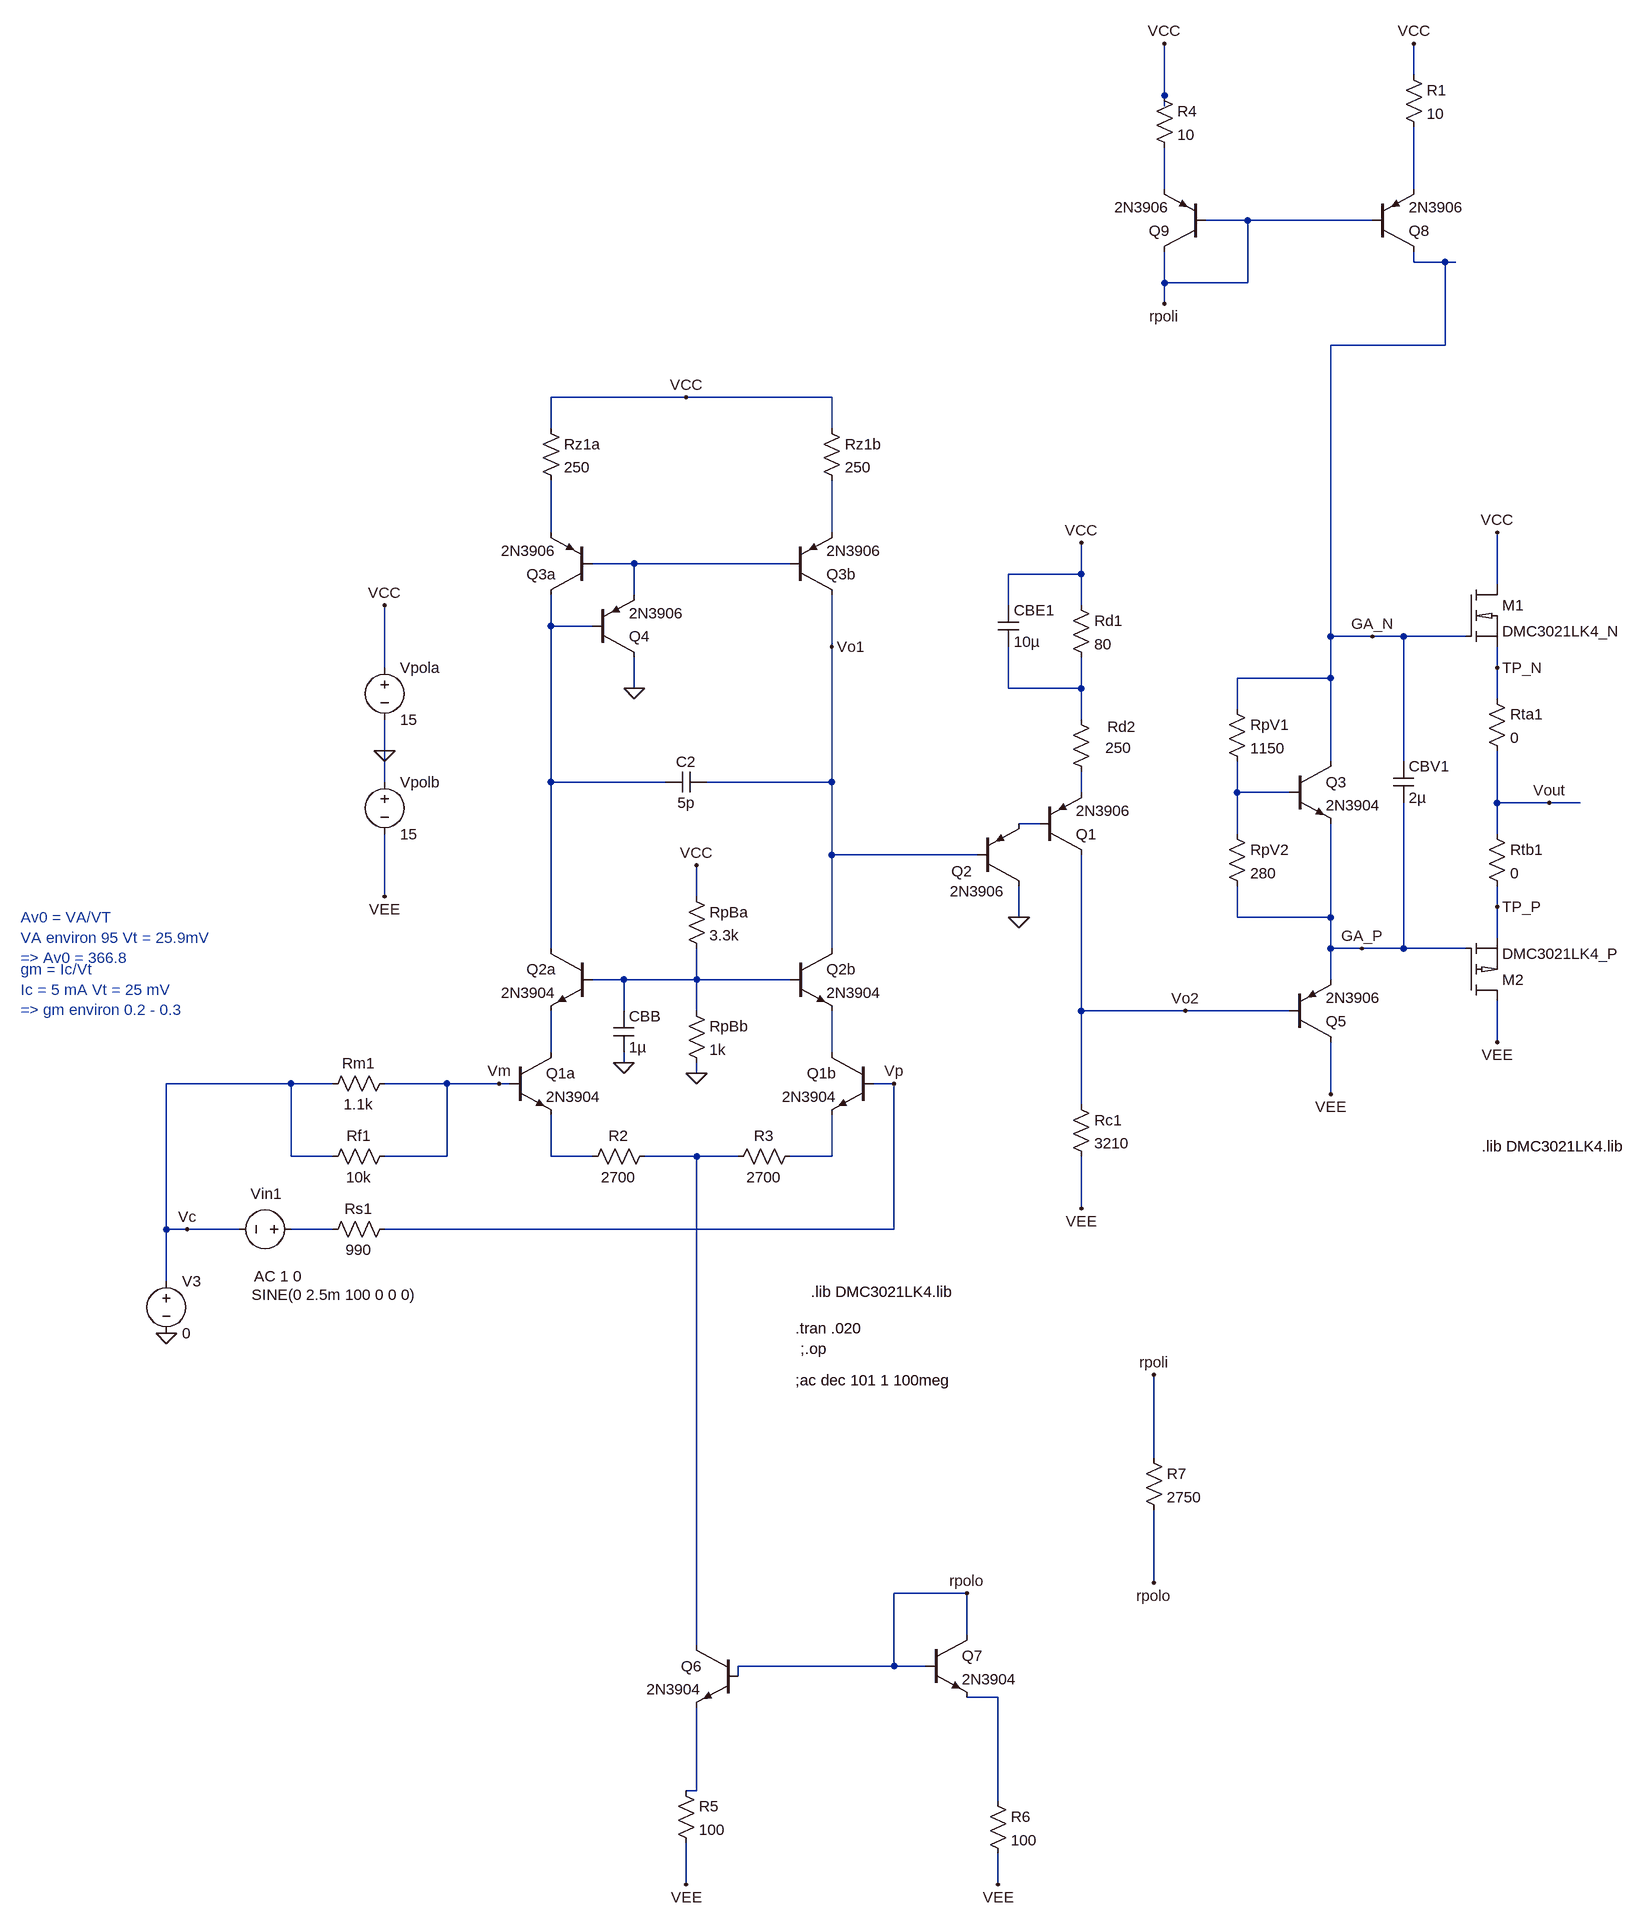
[diagram p0: schematic LT_COMPLET_DEVELOPPEMENT.asc]
LT_COMPLET_DEVELOPPEMENT.asc, the LTspice schematic file:
Version 4
SHEET 1 2404 1688
WIRE 1408 -1184 1408 -1232
WIRE 1024 -1152 1024 -1232
WIRE 1024 -1136 1024 -1152
WIRE 1024 -1008 1024 -1072
WIRE 1408 -1008 1408 -1104
WIRE 1152 -960 1088 -960
WIRE 1344 -960 1152 -960
WIRE 1408 -896 1408 -912
WIRE 1456 -896 1408 -896
WIRE 1472 -896 1456 -896
WIRE 1024 -864 1024 -912
WIRE 1152 -864 1152 -960
WIRE 1152 -864 1024 -864
WIRE 1024 -832 1024 -864
WIRE 1456 -768 1456 -896
WIRE 1456 -768 1280 -768
WIRE 288 -688 80 -688
WIRE 512 -688 288 -688
WIRE 80 -640 80 -688
WIRE 512 -640 512 -688
WIRE 80 -480 80 -560
WIRE 512 -480 512 -560
WIRE 208 -432 144 -432
WIRE 448 -432 208 -432
WIRE 896 -416 896 -464
WIRE 896 -416 784 -416
WIRE 1536 -400 1536 -480
WIRE 208 -384 208 -432
WIRE 784 -368 784 -416
WIRE 896 -368 896 -416
WIRE 80 -336 80 -384
WIRE 144 -336 80 -336
WIRE 1280 -320 1280 -768
WIRE 1344 -320 1280 -320
WIRE 1392 -320 1344 -320
WIRE 1488 -320 1392 -320
WIRE 512 -304 512 -384
WIRE -176 -272 -176 -368
WIRE 1536 -272 1536 -304
WIRE 1280 -256 1280 -320
WIRE 1280 -256 1136 -256
WIRE 208 -240 208 -288
WIRE 784 -240 784 -304
WIRE 896 -240 896 -288
WIRE 896 -240 784 -240
WIRE 1536 -224 1536 -272
WIRE 1136 -208 1136 -256
WIRE 896 -192 896 -240
WIRE -176 -144 -176 -192
WIRE 1280 -128 1280 -256
WIRE 1392 -128 1392 -320
WIRE -176 -96 -176 -144
WIRE 80 -96 80 -336
WIRE 256 -96 80 -96
WIRE 512 -96 512 -304
WIRE 512 -96 320 -96
WIRE 896 -80 896 -112
WIRE 1136 -80 1136 -128
WIRE 1216 -80 1136 -80
WIRE 1536 -64 1536 -144
WIRE 1616 -64 1536 -64
WIRE 1664 -64 1616 -64
WIRE 832 -32 800 -32
WIRE 1136 -16 1136 -80
WIRE 1536 -16 1536 -64
WIRE 512 16 512 -96
WIRE 736 16 512 16
WIRE -176 80 -176 -16
WIRE 304 80 304 32
WIRE 1536 96 1536 64
WIRE 800 112 800 64
WIRE 1136 112 1136 64
WIRE 1280 112 1280 -32
WIRE 1280 112 1136 112
WIRE 1536 144 1536 96
WIRE 80 160 80 -96
WIRE 512 160 512 16
WIRE 1280 160 1280 112
WIRE 1328 160 1280 160
WIRE 1392 160 1392 -64
WIRE 1392 160 1328 160
WIRE 1488 160 1392 160
WIRE 192 208 144 208
WIRE 304 208 304 160
WIRE 304 208 192 208
WIRE 448 208 304 208
WIRE 1280 208 1280 160
WIRE 192 256 192 208
WIRE 304 256 304 208
WIRE 896 256 896 16
WIRE 1056 256 896 256
WIRE 1216 256 1056 256
WIRE 1536 304 1536 240
WIRE 80 320 80 256
WIRE 512 320 512 256
WIRE 192 336 192 320
WIRE 304 352 304 336
WIRE -320 368 -512 368
WIRE -256 368 -320 368
WIRE -80 368 -176 368
WIRE 0 368 -80 368
WIRE 16 368 0 368
WIRE 608 368 576 368
WIRE 1280 384 1280 304
WIRE 896 400 896 256
WIRE -320 480 -320 368
WIRE -256 480 -320 480
WIRE -80 480 -80 368
WIRE -80 480 -176 480
WIRE 80 480 80 416
WIRE 144 480 80 480
WIRE 304 480 224 480
WIRE 368 480 304 480
WIRE 512 480 512 416
WIRE 512 480 448 480
WIRE 896 560 896 480
WIRE -512 592 -512 368
WIRE -480 592 -512 592
WIRE -400 592 -480 592
WIRE -256 592 -320 592
WIRE 608 592 608 368
WIRE 608 592 -176 592
WIRE -512 672 -512 592
WIRE 1008 944 1008 816
WIRE 1008 1136 1008 1024
WIRE 720 1152 608 1152
WIRE 720 1216 720 1152
WIRE 304 1232 304 480
WIRE 608 1264 608 1152
WIRE 608 1264 368 1264
WIRE 656 1264 608 1264
WIRE 368 1280 368 1264
WIRE 768 1312 720 1312
WIRE 304 1456 304 1328
WIRE 304 1456 288 1456
WIRE 768 1472 768 1312
WIRE 288 1600 288 1536
WIRE 768 1600 768 1552
FLAG 288 -688 VCC
FLAG -176 -368 VCC
FLAG -176 80 VEE
FLAG -176 -144 0
FLAG 512 -304 Vo1
FLAG 608 368 Vp
FLAG 208 -240 0
FLAG 0 368 Vm
FLAG -512 752 0
FLAG -480 592 Vc
FLAG 304 352 0
FLAG 304 32 VCC
FLAG 192 336 0
FLAG 896 -464 VCC
FLAG 800 112 0
FLAG 896 560 VEE
FLAG 1536 -480 VCC
FLAG 1536 304 VEE
FLAG 1280 384 VEE
FLAG 1344 -320 GA_N
FLAG 1328 160 GA_P
FLAG 1616 -64 Vout
FLAG 1536 -272 TP_N
FLAG 1536 96 TP_P
FLAG 1056 256 Vo2
FLAG 288 1600 VEE
FLAG 768 1600 VEE
FLAG 1024 -1232 VCC
FLAG 1408 -1232 VCC
FLAG 720 1152 rpolo
FLAG 1008 1136 rpolo
FLAG 1024 -832 rpoli
FLAG 1008 816 rpoli
SYMBOL npn 16 320 R0
SYMATTR InstName Q1a
SYMATTR Value 2N3904
SYMBOL npn 576 320 M0
SYMATTR InstName Q1b
SYMATTR Value 2N3904
SYMBOL npn 448 160 R0
SYMATTR InstName Q2b
SYMATTR Value 2N3904
SYMBOL npn 144 160 M0
SYMATTR InstName Q2a
SYMATTR Value 2N3904
SYMBOL pnp 144 -384 R180
SYMATTR InstName Q3a
SYMATTR Value 2N3906
SYMBOL pnp 144 -288 M180
SYMATTR InstName Q4
SYMATTR Value 2N3906
SYMBOL pnp 448 -384 M180
SYMATTR InstName Q3b
SYMATTR Value 2N3906
SYMBOL res 64 -656 R0
SYMATTR InstName Rz1a
SYMATTR Value 250
SYMBOL res 496 -656 R0
SYMATTR InstName Rz1b
SYMATTR Value 250
SYMBOL voltage -176 -288 R0
WINDOW 123 0 0 Left 0
WINDOW 39 0 0 Left 0
SYMATTR InstName Vpola
SYMATTR Value 15
SYMBOL voltage -176 -112 R0
WINDOW 123 0 0 Left 0
WINDOW 39 0 0 Left 0
SYMATTR InstName Vpolb
SYMATTR Value 15
SYMBOL res 240 464 R90
WINDOW 0 0 56 VBottom 2
WINDOW 3 32 56 VTop 2
SYMATTR InstName R2
SYMATTR Value 2700
SYMBOL res 464 464 R90
WINDOW 0 0 56 VBottom 2
WINDOW 3 32 56 VTop 2
SYMATTR InstName R3
SYMATTR Value 2700
SYMBOL res -160 576 R90
WINDOW 0 0 56 VBottom 2
WINDOW 3 32 56 VTop 2
SYMATTR InstName Rs1
SYMATTR Value 990
SYMBOL res -160 352 R90
WINDOW 0 0 56 VBottom 2
WINDOW 3 32 56 VTop 2
SYMATTR InstName Rm1
SYMATTR Value 1.1k
SYMBOL res -160 464 R90
WINDOW 0 0 56 VBottom 2
WINDOW 3 32 56 VTop 2
SYMATTR InstName Rf1
SYMATTR Value 10k
SYMBOL voltage -512 656 R0
WINDOW 123 0 0 Left 0
WINDOW 39 0 0 Left 0
SYMATTR InstName V3
SYMATTR Value 0
SYMBOL res 288 240 R0
SYMATTR InstName RpBb
SYMATTR Value 1k
SYMBOL res 288 64 R0
SYMATTR InstName RpBa
SYMATTR Value 3.3k
SYMBOL cap 176 256 R0
SYMATTR InstName CBB
SYMATTR Value 1µ
SYMBOL voltage -304 592 R90
WINDOW 123 72 73 VLeft 2
WINDOW 39 0 0 Left 0
WINDOW 3 101 77 VLeft 2
WINDOW 0 -55 78 VLeft 2
SYMATTR Value2 AC 1 0
SYMATTR Value SINE(0 2.5m 100 0 0 0)
SYMATTR InstName Vin1
SYMBOL pnp 832 16 M180
SYMATTR InstName Q1
SYMATTR Value 2N3906
SYMBOL pnp 736 64 M180
WINDOW 0 -40 23 Left 2
WINDOW 3 -42 -8 Left 2
SYMATTR InstName Q2
SYMATTR Value 2N3906
SYMBOL cap 768 -368 R0
SYMATTR InstName CBE1
SYMATTR Value 10µ
SYMBOL res 880 -384 R0
SYMATTR InstName Rd1
SYMATTR Value 80
SYMBOL res 880 -208 R0
WINDOW 0 56 27 Left 2
WINDOW 3 53 59 Left 2
SYMATTR InstName Rd2
SYMATTR Value 250
SYMBOL res 880 384 R0
SYMATTR InstName Rc1
SYMATTR Value 3210
SYMBOL res 1520 -240 R0
SYMATTR InstName Rta1
SYMATTR Value 0
SYMBOL res 1520 -32 R0
SYMATTR InstName Rtb1
SYMATTR Value 0
SYMBOL npn 1216 -128 R0
SYMATTR InstName Q3
SYMATTR Value 2N3904
SYMBOL res 1120 -224 R0
SYMATTR InstName RpV1
SYMATTR Value 1150
SYMBOL res 1120 -32 R0
SYMATTR InstName RpV2
SYMATTR Value 280
SYMBOL pnp 1216 304 M180
SYMATTR InstName Q5
SYMATTR Value 2N3906
SYMBOL cap 1376 -128 R0
SYMATTR InstName CBV1
SYMATTR Value 2µ
SYMBOL nmos_3021 1488 -400 R0
SYMATTR InstName M1
SYMBOL pmos_3021 1488 240 M180
SYMATTR InstName M2
SYMBOL cap 320 -112 R90
WINDOW 0 0 32 VBottom 2
WINDOW 3 32 32 VTop 2
SYMATTR InstName C2
SYMATTR Value 5p
SYMBOL res 272 1440 R0
SYMATTR InstName R5
SYMATTR Value 100
SYMBOL res 752 1456 R0
SYMATTR InstName R6
SYMATTR Value 100
SYMBOL npn 368 1232 M0
SYMATTR InstName Q6
SYMATTR Value 2N3904
SYMBOL npn 656 1216 R0
SYMATTR InstName Q7
SYMATTR Value 2N3904
SYMBOL res 1392 -1200 R0
SYMATTR InstName R1
SYMATTR Value 10
SYMBOL res 1008 -1168 R0
SYMATTR InstName R4
SYMATTR Value 10
SYMBOL pnp 1344 -912 M180
SYMATTR InstName Q8
SYMATTR Value 2N3906
SYMBOL pnp 1088 -912 R180
SYMATTR InstName Q9
SYMATTR Value 2N3906
SYMBOL res 992 928 R0
SYMATTR InstName R7
SYMATTR Value 2750
TEXT 464 776 Left 2 !;.op
TEXT 456 824 Left 2 !;ac dec 101 1 100meg
TEXT 456 744 Left 2 !.tran .020
TEXT 480 688 Left 2 !.lib DMC3021LK4.lib
TEXT -736 112 Left 2 ;Av0 = VA/VT \nVA environ 95 Vt = 25.9mV \n=> Av0 = 366.8
TEXT -736 192 Left 2 ;gm = Ic/Vt  \nIc = 5 mA Vt = 25 mV \n=> gm environ 0.2 - 0.3
TEXT 1512 464 Left 2 !.lib DMC3021LK4.lib

The netlist it stands for:
* LT_COMPLET_DEVELOPPEMENT.asc
Q1a N012 Vm N014 0 2N3904
Q1b N013 Vp N016 0 2N3904
Q2b Vo1 N011 N013 0 2N3904
Q2a N006 N011 N012 0 2N3904
Q3a N006 N005 N003 0 2N3906
Q4 0 N006 N005 0 2N3906
Q3b Vo1 N005 N004 0 2N3906
Rz1a VCC N003 250
Rz1b VCC N004 250
Vpola VCC 0 15
Vpolb 0 VEE 15
R2 N015 N014 2700
R3 N016 N015 2700
Rs1 Vp N017 990
Rm1 Vm Vc 1.1k
Rf1 Vm Vc 10k
V3 Vc 0 0
RpBb N011 0 1k
RpBa VCC N011 3.3k
CBB N011 0 1µ
Vin1 N017 Vc SINE(0 2.5m 100 0 0 0) AC 1 0
Q1 Vo2 N010 N008 0 2N3906
Q2 0 Vo1 N010 0 2N3906
CBE1 VCC N007 10µ
Rd1 VCC N007 80
Rd2 N007 N008 250
Rc1 Vo2 VEE 3210
Rta1 TP_N Vout 0
Rtb1 Vout TP_P 0
Q3 GA_N N009 GA_P 0 2N3904
RpV1 GA_N N009 1150
RpV2 N009 GA_P 280
Q5 VEE Vo2 GA_P 0 2N3906
CBV1 GA_N GA_P 2µ
XM1 VCC GA_N TP_N DMC3021LK4_N  ; pins D G S
XM2 VEE GA_P TP_P DMC3021LK4_P  ; pins D G S
C2 Vo1 N006 5p
R5 N019 VEE 100
R6 N018 VEE 100
Q6 N015 rpolo N019 0 2N3904
Q7 rpolo rpolo N018 0 2N3904
R1 VCC N002 10
R4 VCC N001 10
Q8 GA_N rpoli N002 0 2N3906
Q9 rpoli rpoli N001 0 2N3906
R7 rpoli rpolo 2750
.model NPN NPN
.model PNP PNP
.lib standard.bjt
;.op
;ac dec 101 1 100meg
.tran .020
.lib DMC3021LK4.lib
* Av0 = VA/VT
* VA environ 95 Vt = 25.9mV
* => Av0 = 366.8
* gm = Ic/Vt
* Ic = 5 mA Vt = 25 mV
* => gm environ 0.2 - 0.3
.lib DMC3021LK4.lib
.lib DMC3021LK4.lib
.backanno
.end